# EAGLE design Simplified 4 ch sample-and-hold without mux v1.0 (EAGLE 9.5.2)
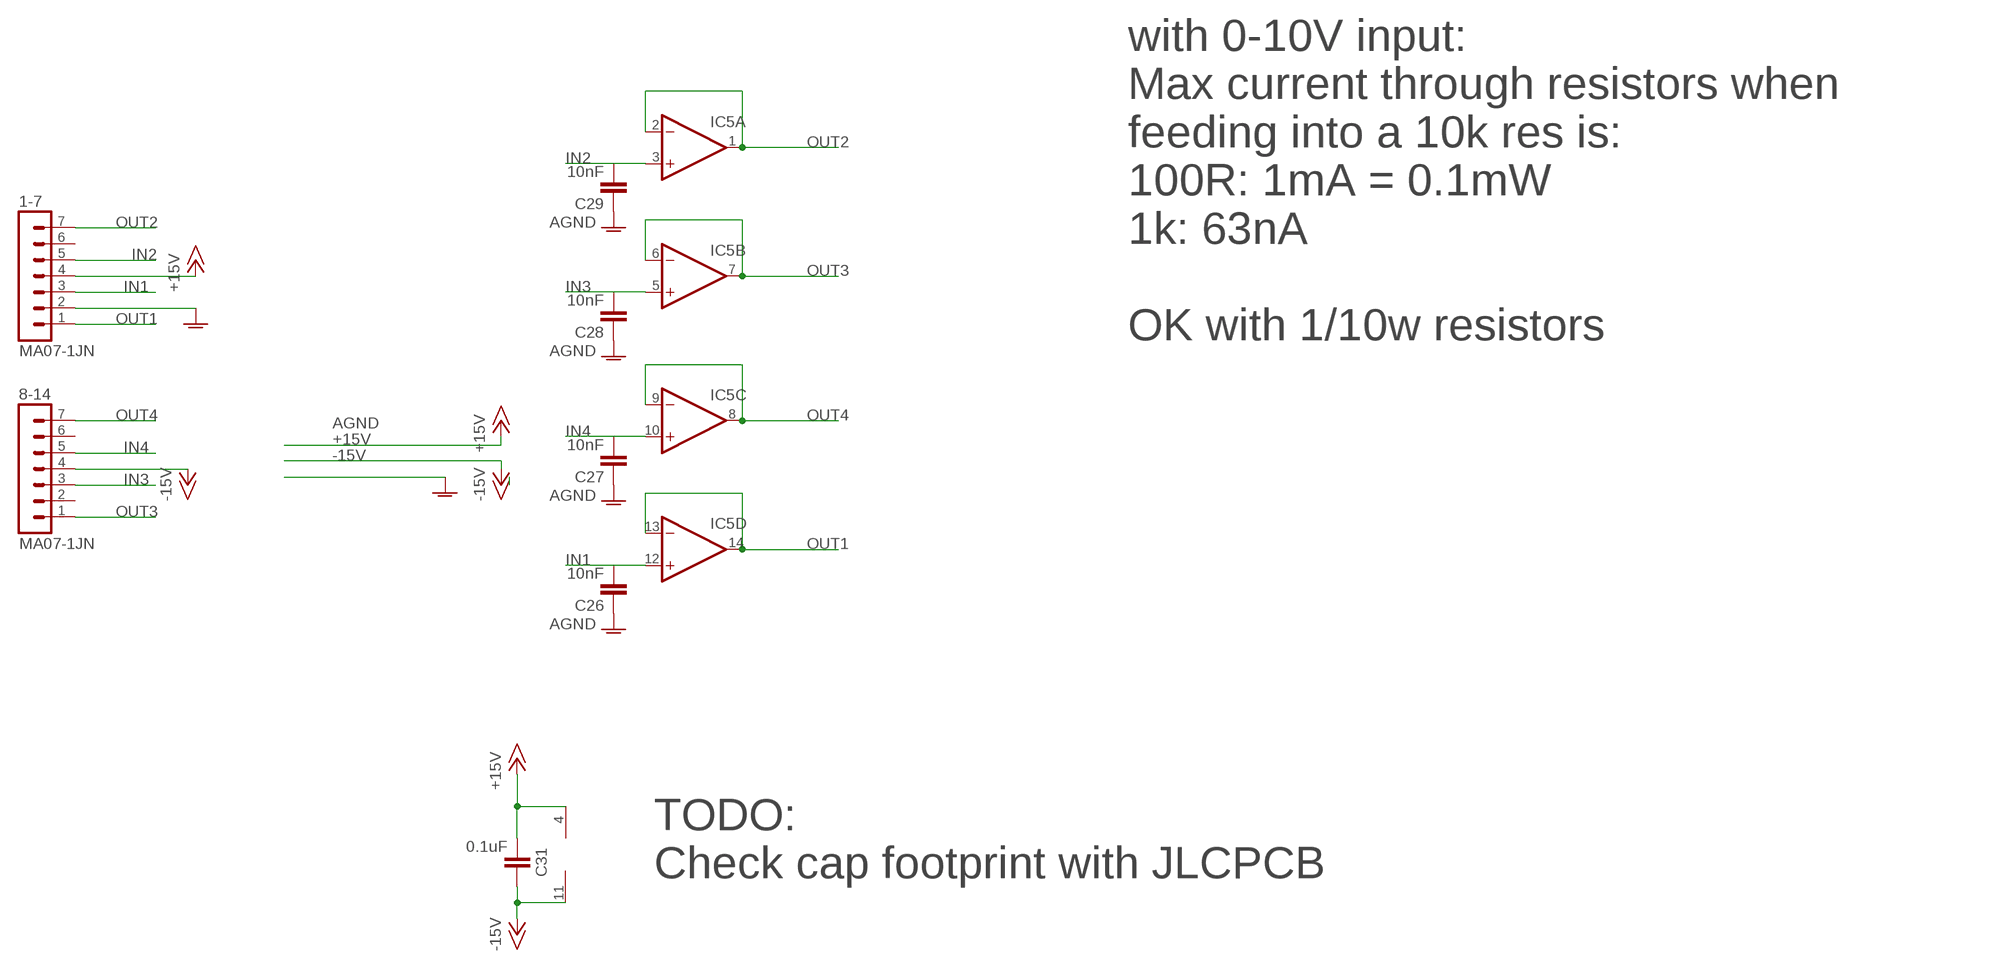
[diagram p0: schematic, sheet 1]

## Parts
1-7  MA07-1JN  [MA07N-1J]
8-14  MA07-1JN  [MA07N-1J]
C26  10nF  C-EUC0805  [C0805]
C27  10nF  C-EUC0805  [C0805]
C28  10nF  C-EUC0805  [C0805]
C29  10nF  C-EUC0805  [C0805]
C31  0.1uF  C-EUC0603  [C0603]
IC5  TL084CPWR  TL074JT  [TSSOP14J]

## Nets
+15V: 1-7.4 C31.1 IC5.4(P:V+)
-15V: 8-14.4 C31.2 IC5.11(P:V-)
AGND: 1-7.2 C26.1 C27.1 C28.1 C29.1
IN1: 1-7.3 C26.2 IC5.12(D:+IN)
IN2: 1-7.5 C29.2 IC5.3(A:+IN)
IN3: 8-14.3 C28.2 IC5.5(B:+IN)
IN4: 8-14.5 C27.2 IC5.10(C:+IN)
OUT1: 1-7.1 IC5.13(D:-IN) IC5.14(D:OUT)
OUT2: 1-7.7 IC5.1(A:OUT) IC5.2(A:-IN)
OUT3: 8-14.1 IC5.6(B:-IN) IC5.7(B:OUT)
OUT4: 8-14.7 IC5.8(C:OUT) IC5.9(C:-IN)
Unconnected: 1-7.6 8-14.2 8-14.6

## Notes on the sheet
- with 0-10V input:
  Max current through resistors when
  feeding into a 10k res is:
  100R: 1mA = 0.1mW
  1k: 63nA
  
  OK with 1/10w resistors
- TODO: 
  Check cap footprint with JLCPCB

## Library data of the parts
1-7 8-14 = joakim:MA07-1J
C26-C29 = rcl:C-EU: CAPACITOR, European symbol; SPICEPREFIX: C
C31 = resistor:C-EU: CAPACITOR, European symbol
IC5 = joakim:TL074J: OP AMP

## Board
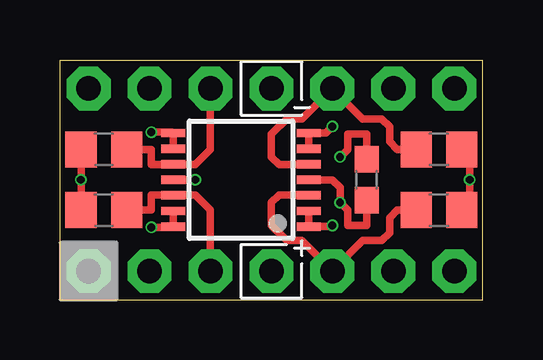
[diagram p1: board, top side]
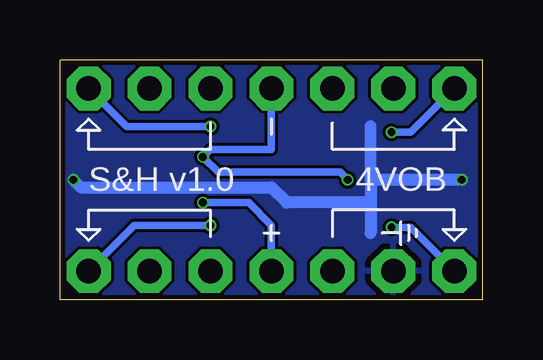
[diagram p2: board, bottom side, seen from below]

Size 17.62 x 10 mm. Coordinates in mm from the lower left corner, seen from the top.
Outline: 0,0 17.62,0 17.62,10 0,10 0,0
Copper layers (1*16): Top 0.035mm / dielectric 1.6mm / Bottom 0.035mm
Design rules "jlcpcb-2layers": minimum track width 5mil, minimum drill 0.3mm, track to track 5mil, track to pad 5mil, pad to pad 5mil, via to via 5mil, smd to smd 5mil, copper to edge 0.2mm, drill to drill 6mil, minimum pad ring 10mil, minimum via ring 3mil, stop-mask expansion 4mil, vias tented up to drill 0mil, thermal gap 10mil

### Footprints (pad centres in the part's own frame; a part is rotated, then mirrored left to right if it is on the bottom)
MA07N-1J = drill 1.016 octagon: 1 -7.62,0; 2 -5.08,0; 3 -2.54,0; 4 0,0; 5 2.54,0; 6 5.08,0; 7 7.62,0
C0805 = smd 1.3 x 1.5: 1 -0.95,0; 2 0.95,0
C0603 = smd 1.1 x 1: 1 -0.85,0; 2 0.85,0
TSSOP14J = smd 0.35 x 1: 1 -1.95,-2.825; 2 -1.3,-2.825; 3 -0.65,-2.825; 4 0,-2.825; 5 0.65,-2.825; 6 1.3,-2.825; 7 1.95,-2.825; 8 1.95,2.825; 9 1.3,2.825; 10 0.65,2.825; 11 0,2.825; 12 -0.65,2.825; 13 -1.3,2.825; 14 -1.95,2.825

### Placement (x,y rotation side)
1-7  8.81,1.19 0 top
8-14  8.81,8.81 180 top
C26  1.83,3.73 0 top
C27  1.83,6.27 0 top
C28  15.8,6.27 180 top
C29  15.8,3.73 180 top
C31  12.78,5 90 top
IC5  TL074JT  [TSSOP14J]  7.54,5 90 top

### Tracks (layer width: path | path; a pad name or v marks a point on that pad's centre or on a via)
+15V  (via drill 0.33)
  Top 0.305: IC5.4 11.35,5 11.67,4.68 v11.67,4.05 11.99,3.73 11.99,3.1 12.78,3.1 C31.1
  Bottom 0.305: v11.67,4.05 9.76,4.05 8.81,3.1 1-7.4
-15V  (via drill 0.33)
  Top 0.305: v5.64,5 IC5.11 | C31.2 12.78,6.91 11.99,6.91 11.99,6.27 v11.67,5.95
  Bottom 0.305: 8-14.4 8.81,6.27 11.35,6.27 v11.67,5.95 11.03,5.32 5.95,5.32 v5.64,5
AGND  (via drill 0.33)
  Top 0.305: C27.1 v0.88,5 | v0.88,5 v0.87,5 | C28.1 17.07,5.95 v17.07,5 17.07,4.05 C29.1 | C26.1 v0.88,5
  Bottom 0.508: v0.87,5 4.68,5 | 4.68,5 4.68,4.05 | 4.68,4.05 4.68,2.78 | 4.68,5 4.68,7.22 | 4.68,4.05 8.18,4.05 8.81,4.68 16.75,4.68 v17.07,5
  pour Bottom: -0.64,11.35 -0.64,-0.32 18.26,-0.32 18.26,11.35
IN1
  Top 0.305: C26.2 3.81,3.73 3.81,4.37 4.7,4.37 | 4.7,4.37 IC5.12 | 1-7.3 6.27,3.73 5.64,4.37 4.7,4.37
IN2
  Top 0.305: IC5.3 10.35,4.37 9.13,4.37 8.81,4.05 8.81,3.1 9.45,2.46 10.08,2.46 1-7.5 12.62,2.46 13.41,2.46 13.73,2.78 13.73,3.41 14.05,3.73 C29.2
IN3
  Top 0.305: IC5.5 10.35,5.64 9.13,5.64 8.81,5.95 8.81,6.91 9.45,7.54 10.08,7.54 8-14.3 12.62,7.54 13.41,7.54 13.73,7.22 13.73,6.59 14.05,6.27 C28.2
IN4
  Top 0.305: C27.2 3.81,6.27 3.81,5.64 4.7,5.64 IC5.10 4.73,5.64 5.64,5.64 6.27,6.27 8-14.5
OUT1  (via drill 0.33)
  Top 0.305: IC5.13 IC5.14 4.68,3.02 v3.81,3.02
  Bottom 0.305: 1-7.1 3.02,3.02 v3.81,3.02
OUT2  (via drill 0.33)
  Top 0.305: v11.35,3.1 11.31,3.05 IC5.1 IC5.2
  Bottom 0.305: v11.35,3.1 14.53,3.1 1-7.7
OUT3  (via drill 0.33)
  Top 0.305: v11.35,7.22 11.08,6.95 IC5.7 IC5.6
  Bottom 0.305: 8-14.1 14.84,7.22 v11.35,7.22
OUT4  (via drill 0.33)
  Top 0.305: v3.81,6.99 4.68,6.99 IC5.8 IC5.9
  Bottom 0.305: 8-14.7 3.02,6.99 v3.81,6.99

### Text on the board
bNames: 4VOB | S&H v1.0